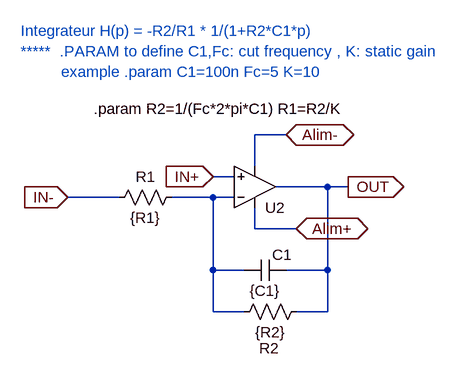
[diagram p0: schematic integrateur-SUB.asc]
integrateur-SUB.asc, the LTspice schematic file:
Version 4
SHEET 1 1244 900
WIRE -1968 -80 -2016 -80
WIRE -2016 -32 -2016 -80
WIRE -2048 -16 -2080 -16
WIRE -1904 0 -1984 0
WIRE -1872 0 -1904 0
WIRE -2224 16 -2304 16
WIRE -2080 16 -2144 16
WIRE -2048 16 -2080 16
WIRE -2016 64 -2016 32
WIRE -1952 64 -2016 64
WIRE -2080 128 -2080 16
WIRE -2032 128 -2080 128
WIRE -1904 128 -1904 0
WIRE -1904 128 -1968 128
WIRE -2080 192 -2080 128
WIRE -2032 192 -2080 192
WIRE -1904 192 -1904 128
WIRE -1904 192 -1952 192
FLAG -2304 16 IN-
IOPIN -2304 16 In
FLAG -1952 64 Alim+
IOPIN -1952 64 BiDir
FLAG -2080 -16 IN+
IOPIN -2080 -16 In
FLAG -1872 0 OUT
IOPIN -1872 0 Out
FLAG -1968 -80 Alim-
IOPIN -1968 -80 BiDir
SYMBOL cap -1968 112 R90
WINDOW 0 8 6 VBottom 2
WINDOW 3 32 32 VTop 2
SYMATTR InstName C1
SYMATTR Value {C1}
SYMBOL res -1936 176 R90
WINDOW 0 88 58 VBottom 2
WINDOW 3 32 56 VTop 2
SYMATTR InstName R2
SYMATTR Value {R2}
SYMBOL res -2128 0 R90
WINDOW 0 0 56 VBottom 2
WINDOW 3 32 56 VTop 2
SYMATTR InstName R1
SYMATTR Value {R1}
SYMBOL Opamps\\UniversalOpamp2 -2016 0 M180
SYMATTR InstName U2
TEXT -2376 -240 Left 2 ;Integrateur H(p) = -R2/R1 * 1/(1+R2*C1*p)\n*****  .PARAM to define C1,Fc: cut frequency , K: static gain\n         example .param C1=100n Fc=5 K=10
TEXT -2264 -120 Left 2 !.param R2=1/(Fc*2*pi*C1) R1=R2/K

The netlist it stands for:
* integrateur-SUB.asc
C1 OUT N001 {C1}
R2 OUT N001 {R2}
R1 N001 IN- {R1}
XU2 IN+ N001 Alim+ Alim- OUT level.2 Avol=1Meg GBW=10Meg Slew=10Meg ilimit=25m rail=0 Vos=0 phimargin=45 en=0 enk=0 in=0 ink=0 Rin=500Meg  ; pins IN+ IN- V+ V- OUT
* Integrateur H(p) = -R2/R1 * 1/(1+R2*C1*p)
* *****  .PARAM to define C1,Fc: cut frequency , K: static gain
*          example .param C1=100n Fc=5 K=10
.param R2=1/(Fc*2*pi*C1) R1=R2/K
.lib UniversalOpamps2.sub
.backanno
.end